# Altium schematic sheet Powerdist.SchDoc
size A
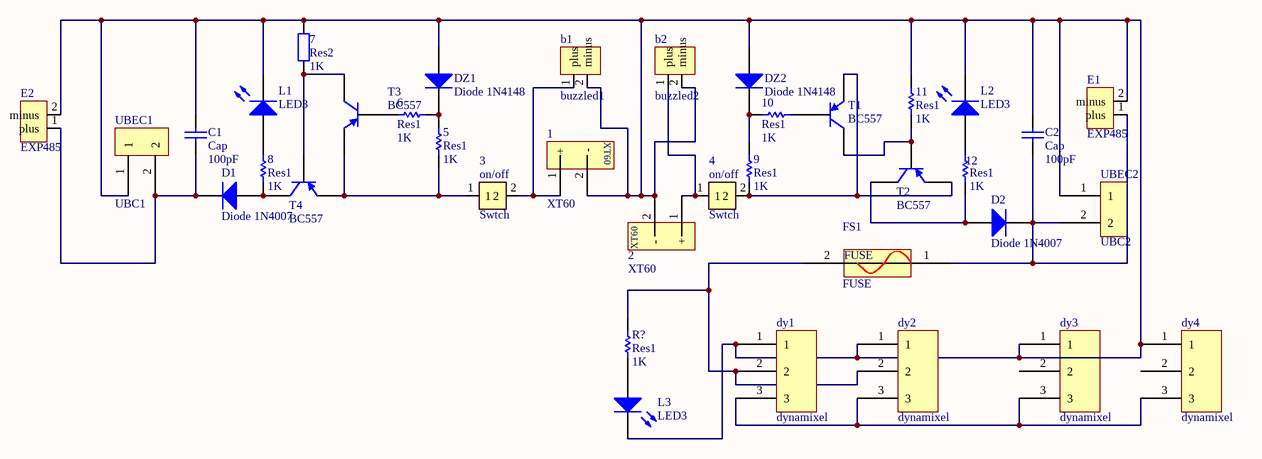
[diagram p0: Powerdist.SchDoc]

## Parts
1  XT60  [PCBComponent_1]
2  XT60  [PCBComponent_1]
3  Swtch  [PCBComponent_1]
4  Swtch  [PCBComponent_1]
5  Res1  value 1K  [AXIAL-0.3]
6  Res1  value 1K  [AXIAL-0.3]
7  Res2  value 1K  [AXIAL-0.4]
8  Res1  value 1K  [AXIAL-0.3]
9  Res1  value 1K  [AXIAL-0.3]
10  Res1  value 1K  [AXIAL-0.3]
11  Res1  value 1K  [AXIAL-0.3]
12  Res1  value 1K  [AXIAL-0.3]
b1  buzzled1  [PCBComponent_1]
b2  buzzled2  [PCBComponent_1]
C1  Cap  value 100pF  [RAD-0.3]
C2  Cap  value 100pF  [RAD-0.3]
D1  Diode 1N4007  [DO-41]
D2  Diode 1N4007  [DO-41]
dy1  dynamixel  [PCBComponent_1]
dy2  dynamixel  [PCBComponent_1]
dy3  dynamixel  [PCBComponent_1]
dy4  dynamixel  [PCBComponent_1]
DZ1  Diode 1N4148  [DO-35]
DZ2  Diode 1N4148  [DO-35]
E1  EXP485  [PCBComponent_1]
E2  EXP485  [PCBComponent_1]
FS1  FUSE  [PCBComponent_1]
L1  LED3  [3.5X2.8X1.9]
L2  LED3  [3.5X2.8X1.9]
L3  LED3  [3.5X2.8X1.9]
R?  Res1  value 1K  [AXIAL-0.3]
T1  BC557  [SOT-23B_N]
T2  BC557  [SOT-23B_N]
T3  BC557  [SOT-23B_N]
T4  BC557  [SOT-23B_N]
UBEC1  UBC1  [PCBComponent_1]
UBEC2  UBC2  [PCBComponent_1]

## Nets
Net1_1: 1.1(+) 3.2 b1.1(plus)
Net1_2: 1.2(-) 2.2(-) 7.2 11.2 b1.2(minus) b2.2(minus) C1.1 C2.1 dy1.1 dy2.1 dy3.1 dy4.1 DZ1.1(A) DZ2.1(A) E1.2(minus) E2.2(minus) L1.2(K) L2.2(K) L3.2(K) UBEC1.1 UBEC2.1
Net2_1: 2.1(+) 4.1 b2.1(plus)
Net3_1: 3.1 5.1 T3.3(E) T4.3(E)
Net4_2: 4.2 9.1 T1.3(E) T2.3(E)
Net5_2: 5.2 6.1 DZ1.2(K)
Net6_2: 6.2 T3.2(B)
Net7_1: 7.1 T3.1(C) T4.2(B)
Net8_1: 8.1 D1.1(A) T4.1(C)
Net8_2: 8.2 L1.1(A)
Net9_2: 9.2 10.1 DZ2.2(K)
Net10_2: 10.2 T1.2(B)
Net11_1: 11.1 T1.1(C) T2.2(B)
Net12_1: 12.1 D2.1(A) T2.1(C)
Net12_2: 12.2 L2.1(A)
NetC1_2: C1.2 D1.2(K) E2.1(plus) UBEC1.2
NetC2_2: C2.2 D2.2(K) E1.1(plus) FS1.1 UBEC2.2
Netdy1_2: dy1.2 dy2.2 FS1.2 R?.2
Netdy1_3: dy1.3 dy2.3 dy3.3 dy4.3
NetL3_1: L3.1(A) R?.1

Not connected (* = marked no-connect by the designer): dy3 2; dy4 2

## Notes on the sheet
- (in symbol Component_1) on/off

## Library data of the parts
1 2 = Component_2
3 4 b1 b2 dy1-dy4 E1 E2 FS1 UBEC1 UBEC2 = Component_1
5 6 8-12 R? = Res1: Resistor; Published: 8-Jun-2000; LatestRevisionDate: 17-Jul-2002; LatestRevisionNote: Re-released for DXP Platform.; PackageReference: AXIAL-0.3; Publisher: Altium Limited; PackageDescription: Axial Device, Thru-Hole; 2 Leads; 0.3 in Pin Spacing
7 = Res2: Resistor; Published: 8-Jun-2000; LatestRevisionDate: 17-Jul-2002; LatestRevisionNote: Re-released for DXP Platform.; PackageReference: AXIAL-0.4; Publisher: Altium Limited; PackageDescription: Axial Device, Thru-Hole; 2 Leads; 0.4 in Pin Spacing
C1 C2 = Cap: Capacitor; Published: 8-Jun-2000; LatestRevisionDate: 17-Jul-2002; LatestRevisionNote: Re-released for DXP Platform.; PackageReference: RAD-0.3; Publisher: Altium Limited; PackageDescription: Radial Cap, Thru-Hole; 2 Leads; 0.3 in Pin Spacing
D1 D2 = Diode 1N4007: 1 Amp General Purpose Rectifier; Published: 8-Jun-2000; LatestRevisionDate: 17-Jul-2002; LatestRevisionNote: Re-released for DXP Platform.; DatasheetVersion: 1998; PackageVersion: Aug-1999; PackageReference: DO-41; Publisher: Altium Limited; PackageDescription: Diode, Axial; Body 5.2 x 2.7 mm (LxDia. max), Lead Dia. 0.86 mm (max); Code_JEDEC: DO-204-AL; ComponentLink1Description: Manufacturer Link; ComponentLink1URL: http://www.fairchildsemi.com/; ComponentLink2Description: Datasheet; ComponentLink2URL: http://www.fairchildsemi.com/ds/1N%2F1N4001.pdf
DZ1 DZ2 = Diode 1N4148: High Conductance Fast Diode; Published: 8-Jun-2000; LatestRevisionDate: 17-Jul-2002; LatestRevisionNote: Re-released for DXP Platform.; DatasheetVersion: 1997; PackageReference: DO-35; Publisher: Altium Limited; PackageDescription: Diode, Axial; Body 3.8 x 1.9 mm (LxDia. max), Lead Dia. 0.53 mm (max); Code_JEDEC: DO-204-AH; ComponentLink1Description: Manufacturer Link; ComponentLink1URL: http://www.fairchildsemi.com/; ComponentLink2Description: Datasheet; ComponentLink2URL: http://www.fairchildsemi.com/ds/1N%2F1N4148.pdf
L1-L3 = LED3: Typical BLUE SiC LED; Published: 8-Jun-2000; LatestRevisionDate: 17-Dec-2003; LatestRevisionNote: PCB Footprint replaced.; DatasheetVersion: 16-Apr-2002; PackageVersion: 16-Apr-2002; PackageReference: 3.5X2.8X1.9; Publisher: Altium Limited; PackageDescription: SM LED; 2 C-Bend Leads; Body 3.5 x 2.8 x 1.9 mm, inc leads (LxWxH typ)
T1-T4 = PNP: PNP Bipolar Transistor; Published: 8-Jun-2000; LatestRevisionDate: 29-May-2009; LatestRevisionNote: IPC-7351 Footprint Added.; PackageVersion: Aug-1999; PackageReference: SOT-23B; Publisher: Altium Limited; PackageDescription: 3-Pin SOT-23 Package 0.95 mm Pitch, 2.4 mm Lead Span